# Altium schematic sheet UI_mon.SchDoc
size A4; DocumentNumber: 28; SheetNumber: 28; SheetTotal: 30
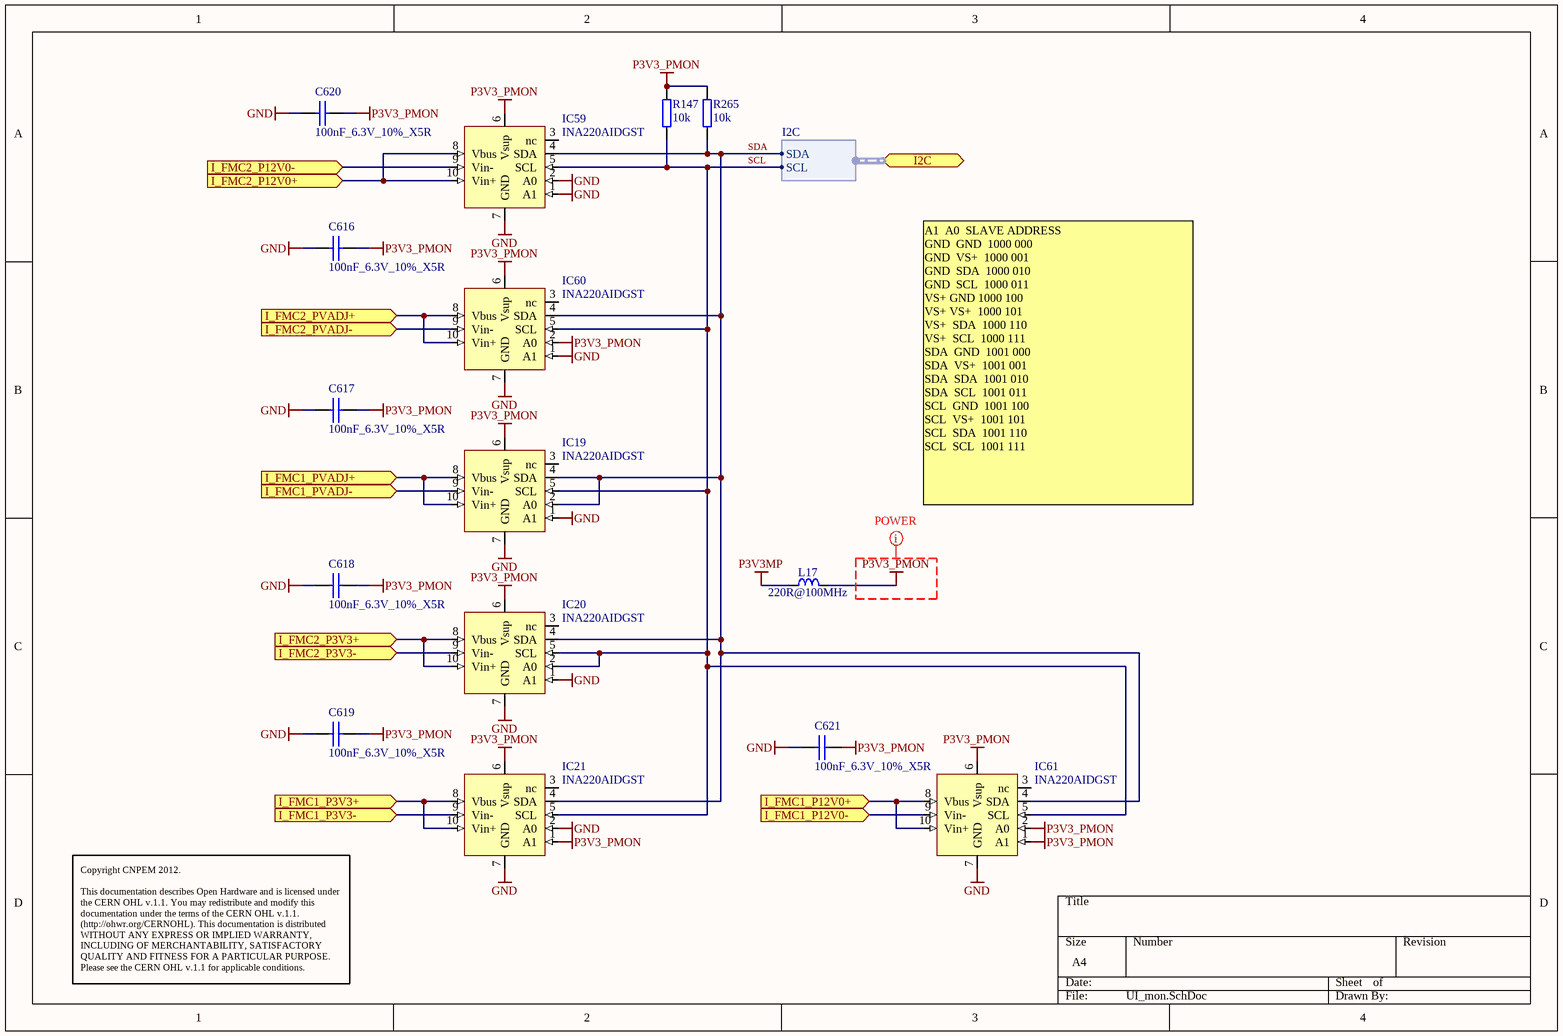
[diagram p0: UI_mon.SchDoc]

## Parts
C616  100nF_6.3V_10%_X5R  [0201C]
C617  100nF_6.3V_10%_X5R  [0201C]
C618  100nF_6.3V_10%_X5R  [0201C]
C619  100nF_6.3V_10%_X5R  [0201C]
C620  100nF_6.3V_10%_X5R  [0201C]
C621  100nF_6.3V_10%_X5R  [0201C]
IC19  INA220AIDGST  [msop10]
IC20  INA220AIDGST  [msop10]
IC21  INA220AIDGST  [msop10]
IC59  INA220AIDGST  [msop10]
IC60  INA220AIDGST  [msop10]
IC61  INA220AIDGST  [msop10]
L17  220R@100MHz  [0603L]
R147  10k  [0402R]
R265  10k  [0402R]

## Ports
I2C (harness I2C), I_FMC1_P3V3+ (in), I_FMC1_P3V3- (in), I_FMC1_P12V0+ (in), I_FMC1_P12V0- (in), I_FMC1_PVADJ+ (in), I_FMC1_PVADJ- (in), I_FMC2_P3V3+ (in), I_FMC2_P3V3- (in), I_FMC2_P12V0+ (in), I_FMC2_P12V0- (in), I_FMC2_PVADJ+ (in), I_FMC2_PVADJ- (in)

## Harnesses
I2C: SCL, SDA

## Nets
GND: C616.2 C617.2 C618.2 C619.2 C620.2 C621.2 IC19.1(A1) IC19.7(GND) IC20.1(A1) IC20.7(GND) IC21.2(A0) IC21.7(GND) IC59.1(A1) IC59.2(A0) IC59.7(GND) IC60.1(A1) IC60.7(GND) IC61.7(GND)
P3V3_PMON: C616.1 C617.1 C618.1 C619.1 C620.1 C621.1 IC19.6(Vsup) IC20.6(Vsup) IC21.1(A1) IC21.6(Vsup) IC59.6(Vsup) IC60.2(A0) IC60.6(Vsup) IC61.1(A1) IC61.2(A0) IC61.6(Vsup) L17.2 R147.2 R265.2
P3V3MP: L17.1
I_FMC1_P3V3+: IC21.8(Vbus) IC21.10(Vin+) ; port I_FMC1_P3V3+
I_FMC1_P3V3-: IC21.9(Vin-) ; port I_FMC1_P3V3-
I_FMC1_P12V0+: IC61.8(Vbus) IC61.10(Vin+) ; port I_FMC1_P12V0+
I_FMC1_P12V0-: IC61.9(Vin-) ; port I_FMC1_P12V0-
I_FMC1_PVADJ+: IC19.8(Vbus) IC19.10(Vin+) ; port I_FMC1_PVADJ+
I_FMC1_PVADJ-: IC19.9(Vin-) ; port I_FMC1_PVADJ-
I_FMC2_P3V3+: IC20.8(Vbus) IC20.10(Vin+) ; port I_FMC2_P3V3+
I_FMC2_P3V3-: IC20.9(Vin-) ; port I_FMC2_P3V3-
I_FMC2_P12V0+: IC59.8(Vbus) IC59.10(Vin+) ; port I_FMC2_P12V0+
I_FMC2_P12V0-: IC59.9(Vin-) ; port I_FMC2_P12V0-
I_FMC2_PVADJ+: IC60.8(Vbus) IC60.10(Vin+) ; port I_FMC2_PVADJ+
I_FMC2_PVADJ-: IC60.9(Vin-) ; port I_FMC2_PVADJ-
SCL: IC19.5(SCL) IC20.2(A0) IC20.5(SCL) IC21.5(SCL) IC59.5(SCL) IC60.5(SCL) IC61.5(SCL) R147.1 ; port I2C.SCL
SDA: IC19.2(A0) IC19.4(SDA) IC20.4(SDA) IC21.4(SDA) IC59.4(SDA) IC60.4(SDA) IC61.4(SDA) R265.1 ; port I2C.SDA

Not connected (* = marked no-connect by the designer): IC19 3(nc); IC20 3(nc); IC21 3(nc); IC59 3(nc); IC60 3(nc); IC61 3(nc)

## Layout directives
net class POWER: P3V3_PMON

## Notes on the sheet
- A1 	A0 	SLAVE ADDRESS
  GND 	GND 	1000 000
  GND 	VS+ 	1000 001
  GND 	SDA 	1000 010
  GND 	SCL 	1000 011
  VS+	GND	1000 100
  VS+	VS+ 	1000 101
  VS+ 	SDA 	1000 110
  VS+ 	SCL 	1000 111
  SDA 	GND 	1001 000
  SDA 	VS+ 	1001 001
  SDA 	SDA 	1001 010
  SDA 	SCL 	1001 011
  SCL 	GND 	1001 100
  SCL 	VS+ 	1001 101
  SCL 	SDA 	1001 110
  SCL 	SCL 	1001 111
- Copyright CNPEM 2012.
  This documentation describes Open Hardware and is licensed under the CERN OHL v.1.1. You may redistribute and modify this documentation under the terms of the CERN OHL v.1.1. (http://ohwr.org/CERNOHL). This documentation is distributed WITHOUT ANY EXPRESS OR IMPLIED WARRANTY, INCLUDING OF MERCHANTABILITY, SATISFACTORY QUALITY AND FITNESS FOR A PARTICULAR PURPOSE. Please see the CERN OHL v.1.1 for applicable conditions.

## Library data of the parts
C616-C621 = CAP_SMD_0201: Capacitor SMD
IC19-IC21 IC59-IC61 = ADC_INA220: CURRENT/POWER MONITOR with Two-Wire Interface
L17 = IND0805_MURATA_BLM21PG221SN1D: Inductor; Part Description: SMD EMIFIL Suppression Chip Bead Ferrite; Manufacturer: MURATA; Power: 2A; Resistance: 0.05R; Tolerance: ±25%; Table: Inductors SMD; Part Number: IND0805_MURATA_BLM21PG221SN1D; Component Kind: Standard; Component Type: Standard; Footprint: INDC2012X105N; Pin Count: 2; Value: 220R@100MHz; Status: None; Manufacturer Part Number: BLM21PG221SN1D; Case: 0805; Mounted: Yes; Socket: No; SMD: Yes; ComponentHeight: 1.05mm; HelpURL: \\cern.ch\dfs\Applications\Altium\Datasheets\IND0402_MURATA_BLM21P.pdf; Author: CERN DEM JLC; CreateDate: 2010-01-25; LatestRevisionDate: 2010-01-25
R147 R265 = RES_0402: SMD Resistor; Supplier 1: Newark; Supplier Part Number 1: 59M6691